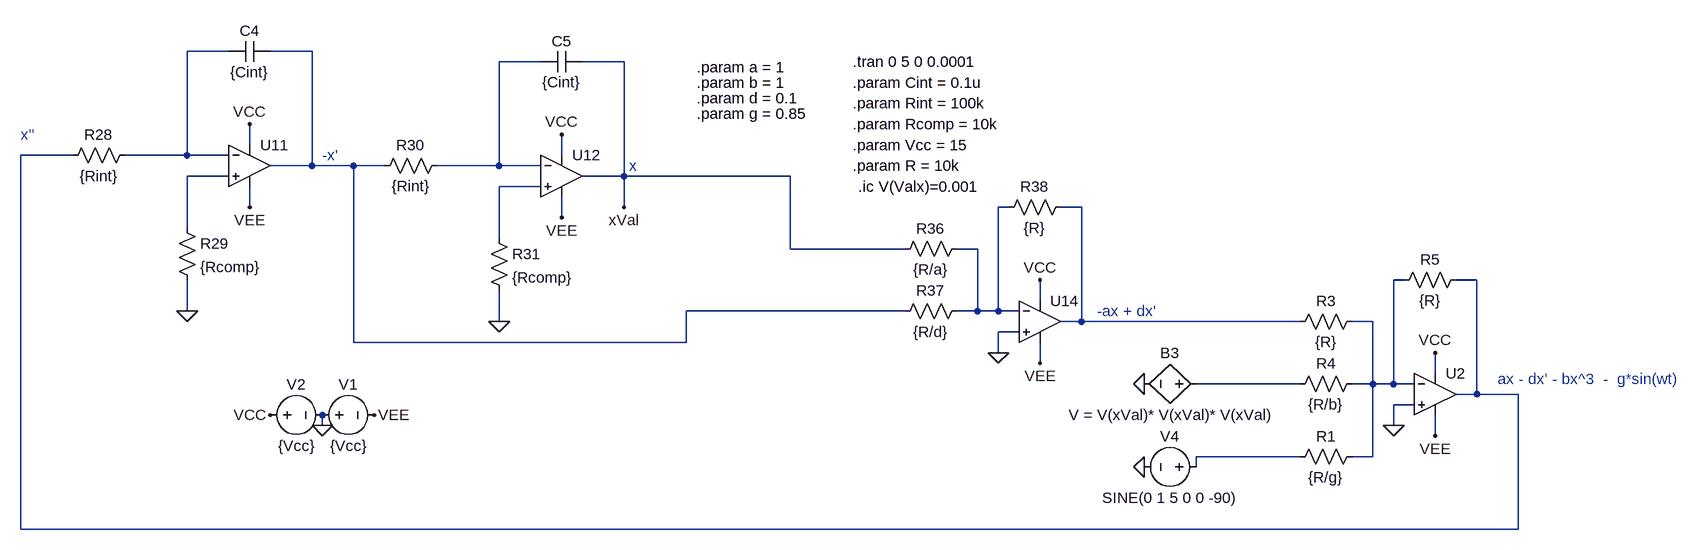
[diagram p0: schematic duffing.asc]
duffing.asc, the LTspice schematic file:
Version 4.1
SHEET 1 1572 3564
WIRE -2160 2496 -2224 2496
WIRE -2032 2496 -2096 2496
WIRE -1680 2512 -1744 2512
WIRE -1552 2512 -1616 2512
WIRE -2128 2640 -2128 2608
WIRE -2400 2656 -2480 2656
WIRE -2224 2656 -2224 2496
WIRE -2224 2656 -2320 2656
WIRE -2160 2656 -2224 2656
WIRE -1648 2656 -1648 2624
WIRE -2032 2672 -2032 2496
WIRE -2032 2672 -2096 2672
WIRE -1968 2672 -2032 2672
WIRE -1920 2672 -1968 2672
WIRE -1744 2672 -1744 2512
WIRE -1744 2672 -1840 2672
WIRE -1680 2672 -1744 2672
WIRE -2160 2688 -2224 2688
WIRE -1552 2688 -1552 2512
WIRE -1552 2688 -1616 2688
WIRE -1296 2688 -1552 2688
WIRE -1680 2704 -1744 2704
WIRE -2128 2736 -2128 2704
WIRE -1552 2736 -1552 2688
WIRE -960 2736 -976 2736
WIRE -848 2736 -880 2736
WIRE -1648 2752 -1648 2720
WIRE -2224 2768 -2224 2688
WIRE -1744 2784 -1744 2704
WIRE -1296 2800 -1296 2688
WIRE -1120 2800 -1296 2800
WIRE -1008 2800 -1040 2800
WIRE -352 2848 -368 2848
WIRE -240 2848 -272 2848
WIRE -912 2880 -912 2848
WIRE -2224 2896 -2224 2848
WIRE -1120 2896 -1456 2896
WIRE -1008 2896 -1008 2800
WIRE -1008 2896 -1040 2896
WIRE -976 2896 -976 2736
WIRE -976 2896 -1008 2896
WIRE -944 2896 -976 2896
WIRE -1744 2912 -1744 2864
WIRE -848 2912 -848 2736
WIRE -848 2912 -880 2912
WIRE -512 2912 -848 2912
WIRE -400 2912 -432 2912
WIRE -944 2928 -976 2928
WIRE -1968 2944 -1968 2672
WIRE -1456 2944 -1456 2896
WIRE -1456 2944 -1968 2944
WIRE -976 2960 -976 2928
WIRE -912 2976 -912 2944
WIRE -304 2992 -304 2960
WIRE -512 3008 -672 3008
WIRE -400 3008 -400 2912
WIRE -400 3008 -432 3008
WIRE -368 3008 -368 2848
WIRE -368 3008 -400 3008
WIRE -336 3008 -368 3008
WIRE -240 3024 -240 2848
WIRE -240 3024 -272 3024
WIRE -176 3024 -240 3024
WIRE -336 3040 -368 3040
WIRE -2016 3072 -2016 3056
WIRE -368 3072 -368 3040
WIRE -304 3088 -304 3056
WIRE -512 3120 -672 3120
WIRE -400 3120 -400 3008
WIRE -400 3120 -432 3120
WIRE -672 3136 -672 3120
WIRE -2480 3232 -2480 2656
WIRE -176 3232 -176 3024
WIRE -176 3232 -2480 3232
FLAG -2016 3072 0
FLAG -2096 3056 VCC
FLAG -1936 3056 VEE
FLAG -2128 2608 VCC
FLAG -2128 2736 VEE
FLAG -2224 2896 0
FLAG -1648 2624 VCC
FLAG -1648 2752 VEE
FLAG -1744 2912 0
FLAG -1552 2736 xVal
FLAG -912 2848 VCC
FLAG -912 2976 VEE
FLAG -976 2960 0
FLAG -752 3136 0
FLAG -304 2960 VCC
FLAG -304 3088 VEE
FLAG -368 3072 0
FLAG -752 3008 0
SYMBOL voltage -2032 3056 R270
WINDOW 0 32 56 VTop 2
WINDOW 3 -32 56 VBottom 2
SYMATTR InstName V1
SYMATTR Value {Vcc}
SYMBOL voltage -2112 3056 R270
WINDOW 0 32 56 VTop 2
WINDOW 3 -32 56 VBottom 2
SYMATTR InstName V2
SYMATTR Value {Vcc}
SYMBOL OpAmps\\UniversalOpAmp2 -2128 2672 R0
SYMATTR InstName U11
SYMATTR Value2 Avol=1Meg GBW=1Meg Slew=10Meg
SYMBOL res -2304 2640 R90
WINDOW 0 0 56 VBottom 2
WINDOW 3 32 56 VTop 2
SYMATTR InstName R28
SYMATTR Value {Rint}
SYMBOL res -2240 2752 R0
SYMATTR InstName R29
SYMATTR Value {Rcomp}
SYMBOL cap -2096 2480 R90
WINDOW 0 0 32 VBottom 2
WINDOW 3 32 32 VTop 2
SYMATTR InstName C4
SYMATTR Value {Cint}
SYMBOL OpAmps\\UniversalOpAmp2 -1648 2688 R0
SYMATTR InstName U12
SYMATTR Value2 Avol=1Meg GBW=1Meg Slew=10Meg
SYMBOL res -1824 2656 R90
WINDOW 0 0 56 VBottom 2
WINDOW 3 32 56 VTop 2
SYMATTR InstName R30
SYMATTR Value {Rint}
SYMBOL res -1760 2768 R0
SYMATTR InstName R31
SYMATTR Value {Rcomp}
SYMBOL cap -1616 2496 R90
WINDOW 0 0 32 VBottom 2
WINDOW 3 32 32 VTop 2
SYMATTR InstName C5
SYMATTR Value {Cint}
SYMBOL bv -656 3008 R90
WINDOW 0 -32 56 VBottom 2
WINDOW 3 32 56 VTop 2
SYMATTR InstName B3
SYMATTR Value V = V(xVal)* V(xVal)* V(xVal)
SYMBOL res -1024 2784 R90
WINDOW 0 0 56 VBottom 2
WINDOW 3 32 56 VTop 2
SYMATTR InstName R36
SYMATTR Value {R/a}
SYMBOL res -1024 2880 R90
WINDOW 0 0 56 VBottom 2
WINDOW 3 32 56 VTop 2
SYMATTR InstName R37
SYMATTR Value {R/d}
SYMBOL OpAmps\\UniversalOpAmp2 -912 2912 R0
SYMATTR InstName U14
SYMATTR Value2 Avol=1Meg GBW=1Meg Slew=10Meg
SYMBOL res -864 2720 R90
WINDOW 0 0 56 VBottom 2
WINDOW 3 32 56 VTop 2
SYMATTR InstName R38
SYMATTR Value {R}
SYMBOL voltage -656 3136 R90
WINDOW 0 -32 56 VBottom 2
WINDOW 3 32 56 VTop 2
WINDOW 123 0 0 Left 0
WINDOW 39 0 0 Left 0
SYMATTR InstName V4
SYMATTR Value SINE(0 1 5 0 0 -90)
SYMBOL res -416 2896 R90
WINDOW 0 0 56 VBottom 2
WINDOW 3 32 56 VTop 2
SYMATTR InstName R3
SYMATTR Value {R}
SYMBOL res -416 2992 R90
WINDOW 0 0 56 VBottom 2
WINDOW 3 32 56 VTop 2
SYMATTR InstName R4
SYMATTR Value {R/b}
SYMBOL OpAmps\\UniversalOpAmp2 -304 3024 R0
SYMATTR InstName U2
SYMATTR Value2 Avol=1Meg GBW=1Meg Slew=10Meg
SYMBOL res -256 2832 R90
WINDOW 0 0 56 VBottom 2
WINDOW 3 32 56 VTop 2
SYMATTR InstName R5
SYMATTR Value {R}
SYMBOL res -416 3104 R90
WINDOW 0 0 56 VBottom 2
WINDOW 3 32 56 VTop 2
SYMATTR InstName R1
SYMATTR Value {R/g}
TEXT -1200 2544 Left 2 !.param Cint = 0.1u
TEXT -1200 2608 Left 2 !.param Rcomp = 10k
TEXT -1200 2576 Left 2 !.param Rint = 100k
TEXT -1200 2640 Left 2 !.param Vcc = 15
TEXT -1200 2512 Left 2 !.tran 0 5 0 0.0001
TEXT -1200 2672 Left 2 !.param R = 10k
TEXT -1192 2704 Left 2 !.ic V(Valx)=0.001
TEXT -2480 2624 Left 2 ;x''
TEXT -2016 2656 Left 2 ;-x'
TEXT -1544 2672 Left 2 ;x
TEXT -1440 2568 Left 2 !.param d = 0.1
TEXT -1440 2592 Left 2 !.param g = 0.85
TEXT -1440 2544 Left 2 !.param b = 1
TEXT -1440 2520 Left 2 !.param a = 1
TEXT -824 2896 Left 2 ;-ax + dx'
TEXT -208 3000 Left 2 ;ax - dx' - bx^3  -  g*sin(wt)

The netlist it stands for:
* duffing.asc
V1 0 VEE {Vcc}
V2 VCC 0 {Vcc}
X§U11 N005 N001 VCC VEE N002 level2 Avol=1Meg GBW=1Meg Slew=10Meg Ilimit=25m Rail=0 Vos=0 En=0 Enk=0 In=0 Ink=0 Rin=500Meg  ; pins In+ In- V+ V- OUT
R28 N001 N004 {Rint}
R29 N005 0 {Rcomp}
C4 N002 N001 {Cint}
X§U12 N006 N003 VCC VEE xVal level2 Avol=1Meg GBW=1Meg Slew=10Meg Ilimit=25m Rail=0 Vos=0 En=0 Enk=0 In=0 Ink=0 Rin=500Meg  ; pins In+ In- V+ V- OUT
R30 N003 N002 {Rint}
R31 N006 0 {Rcomp}
C5 xVal N003 {Cint}
B3 N010 0 V = V(xVal)* V(xVal)* V(xVal)
R36 N007 xVal {R/a}
R37 N007 N002 {R/d}
X§U14 0 N007 VCC VEE N008 level2 Avol=1Meg GBW=1Meg Slew=10Meg Ilimit=25m Rail=0 Vos=0 En=0 Enk=0 In=0 Ink=0 Rin=500Meg  ; pins In+ In- V+ V- OUT
R38 N008 N007 {R}
V4 N011 0 SINE(0 1 5 0 0 -90)
R3 N009 N008 {R}
R4 N009 N010 {R/b}
X§U2 0 N009 VCC VEE N004 level2 Avol=1Meg GBW=1Meg Slew=10Meg Ilimit=25m Rail=0 Vos=0 En=0 Enk=0 In=0 Ink=0 Rin=500Meg  ; pins In+ In- V+ V- OUT
R5 N004 N009 {R}
R1 N009 N011 {R/g}
.param Cint = 0.1u
.param Rcomp = 10k
.param Rint = 100k
.param Vcc = 15
.tran 0 5 0 0.0001
.param R = 10k
.ic V(Valx)=0.001
* x''
* -x'
* x
.param d = 0.1
.param g = 0.85
.param b = 1
.param a = 1
* -ax + dx'
* ax - dx' - bx^3  -  g*sin(wt)
.lib UniversalOpAmp2.lib
.backanno
.end